# Altium project LogicShifter.PrjPcb
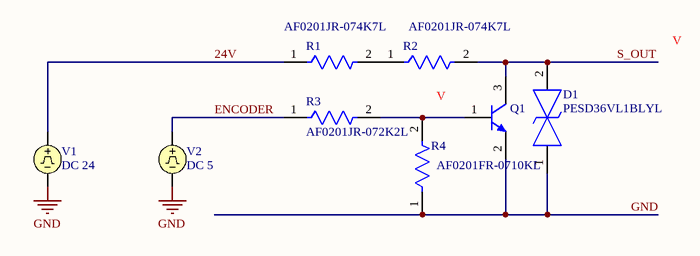
[diagram p0: LogicShifter.SchDoc]
1 sheet, 8 parts. Net scope: global (net labels, ports and power ports of the same name join across sheets).
Board files: LogicShifter.PcbDoc, LogicShifterPanel.PcbDoc

## Sheet LogicShifter.SchDoc
size A; SheetNumber: 1; SheetTotal: 1; SPICEModelCacheMOVBZWSI: <root> / <DocumentId>MOVBZWSI</DocumentId> / <CacheFrame Number="0"> / <Model Name="bc847" Kind="MDL"> / <Text>.MODEL BC847 NPN (IS=45.000F NF=1.010 BF=516.544 VAF=74.000 IKF=0.708 / + ISE=55.668F NE=2.567 NR=1.015 BR=7.745 VAR=14.000 IKR=1.000 / + ISC=1.084P NC=4.063 / + RB=9.000 IRB=0.100M RBM=4.500 / + RE=0.350 RC=1.445 / + CJE=13.050P VJE=0.690 MJE=0.375 FC=0.750 / + CJC=4.100P VJC=0.750 MJC=0.420 XCJC=0.650 / + TF=0.620N TR=2.5N PTF=1.000 / + XTF=68.000 VTF=1.000 ITF=0.720 / + XTB=1.400 EG=1.110 XTI=3.200 / + KF=10.000F AF=1.000)</Text> / </Model> / </CacheFrame> / </root>

### Parts
D1  PESD36VL1BLYL  [PESD36VL1BLYL]
Q1  (no value)  [INF-TSLP-3-1_V]
R1  AF0201JR-074K7L  [FP-AF0201-IPC_B]
R2  AF0201JR-074K7L  [FP-AF0201-IPC_B]
R3  AF0201JR-072K2L  [FP-AF0201-IPC_B]
R4  AF0201FR-0710KL  [FP-AF0201-IPC_B]
V1  DC 24
V2  DC 5

### Nets
GND: D1.1 Q1.2(E) R4.1 V1.2 V2.2
24V: R1.1 V1.1
ENCODER: R3.1 V2.1
S_OUT: D1.2 Q1.3(C) R2.2
NetQ1_1: Q1.1(B) R3.2 R4.2
NetR1_2: R1.2 R2.1

### Library data of the parts
D1 = PESD36VL1BLYL: TVS Diode (Bi-directional); Manufacturer_Name: Nexperia; Datasheet Link: https://assets.nexperia.com/documents/data-sheet/PESD36VL1BL.pdf; Height: 0.5mm; Manufacturer_Part_Number: PESD36VL1BLYL; Arrow Part Number: PESD36VL1BLYL; Arrow Price/Stock: https://www.arrow.com/en/products/pesd36vl1blyl/nexperia?utm_currency=USD&region=nac
Q1 = CMP-1177-00106-1: NPN Silicon AF Transistor, 45 V VCEO, 100 mA IC, TSLP-3-1. BC846BMB,BC847BL3, BC847AMB as counterpart.; Manufacturer: Infineon; fT (typ): 250Â MHz; VCEO (max): 45 V; Ptot (max): 250Â mW; IBM (max): 200Â mA; Packing: Reel; IC (max): 100Â mA; VEBO (max): 6Â V; VCBO (max): 50Â V; ICBO (max): 15Â nA; Green: TRUE; Mounting Technology: Surface Mount; ComponentLink2Description: Datasheet; ComponentLink1URL: http://www.infineon.com/; ComponentLink1Description: Manufacturer URL; PackageDescription: 3-Pin Thin Small Leadless Package, 0.6 x 1 mm Body; ComponentLink2URL: http://www.infineon.com/dgdl/bc847series_bc848series_bc849series_bc850series.pdf?folderId=db3a304314dca389011541d30fa21656&fileId=db3a304314dca389011541d4630a1657; ICM (max): 200Â mA; PartNumber: BC847BL3; ComponentLink3Description: Package Specification; ComponentLink3URL: http://www.infineon.com/dgdl/TSLP-3-1-Package_Overview.pdf?folderId=db3a30431936bc4b011957434db737d2&fileId=db3a30431936bc4b0119577ed2783818; Polarity: NPN; PackageReference: TSLP-3-1; Halogen-free: TRUE
R1 R2 = CMP-03412-043932-1: Anti-Sulfurated Chip Resistors Automotive Grade 4.7kΩ 5% 200ppm/°C 0201; Resistance: 4.7kR; Max Power Dissipation: 50mW; Value: 4.7kR; Max Operating Temperature: 125°C; Features: Moisture Resistant; Number of Terminations: 2; RoHS Compliant: Yes; Packaging: Tape and Reel; Height: 0.01inch; Temperature Coefficient: 200ppm/°C; Length: 0.024inch; Tolerance: 5%; Width: 0.012inch; Case/Package: 0201; Min Operating Temperature: -55°C; Resistor Type: Thick Film; Series: AF
R3 = CMP-03412-038239-1: Anti-Sulfurated Chip Resistors Automotive Grade 2.2kΩ 5% 200ppm/°C 0201; Resistance: 2.2kR; Max Power Dissipation: 50mW; Value: 2.2kR; Temperature Coefficient: 200ppm/°C; Min Operating Temperature: -55°C; Features: Moisture Resistant; Max Operating Temperature: 125°C; Tolerance: 5%; Number of Terminations: 2; Height: 0.01inch; Packaging: Tape and Reel; Length: 0.024inch; Case/Package: 0201; Width: 0.012inch; Series: AF; RoHS Compliant: Yes; Resistor Type: Thick Film
R4 = CMP-03412-039040-1: Anti-Sulfurated Chip Resistors Automotive Grade 10kΩ 1% 200ppm/°C 0201; Max Power Dissipation: 50mW; Resistance: 10kR; Value: 10kR; Width: 0.012inch; Length: 0.024inch; Packaging: Tape and Reel; Case/Package: 0201; Tolerance: 1%; Number of Terminations: 2; RoHS Compliant: Yes; Series: AF; Min Operating Temperature: -55°C; Temperature Coefficient: 200ppm/°C; Height: 0.01inch; Max Operating Temperature: 125°C; Features: Moisture Resistant; Resistor Type: Thick Film
V1 = VPULSE: Pulse Voltage Source; Note: PCB Footprint - Not required; Value: 24; AC Magnitude: 0; Published: 8-Jun-2000; LatestRevisionDate: 15-Nov-2004; LatestRevisionNote: Corrected Netlist.; PackageReference: Not Applicable; Publisher: Altium Limited; AC Phase: 0
V2 = VPULSE: Pulse Voltage Source; Note: PCB Footprint - Not required; Value: 5; AC Magnitude: 0; Published: 8-Jun-2000; LatestRevisionDate: 15-Nov-2004; LatestRevisionNote: Corrected Netlist.; PackageReference: Not Applicable; Publisher: Altium Limited; AC Phase: 0